# Altium schematic sheet LEDs.SchDoc: LEDs
size A4; Organization: Use Organization_Name in ProjParam; Address1: EFI & DBR; Address2: STI-IMT-LSRO1; Address3: EPFL; Address4: CH-1015 LAUSANNE; DocumentNumber: 10; Revision: A; SheetNumber: 10; SheetTotal: 2; ApprovedBy: Init ApprovedBy in DocParam; CheckedBy: Init CheckedBy in DocParam; Author: Init Author in DocParam; CompanyName: Init CompanyName in DocParam; DrawnBy: Init DrawBy in DocParam; Engineer: Init Engineer in DocParam; DocumentName: Init DocumentName in DocParam; ProjectName: Init ProjectName in DocParam
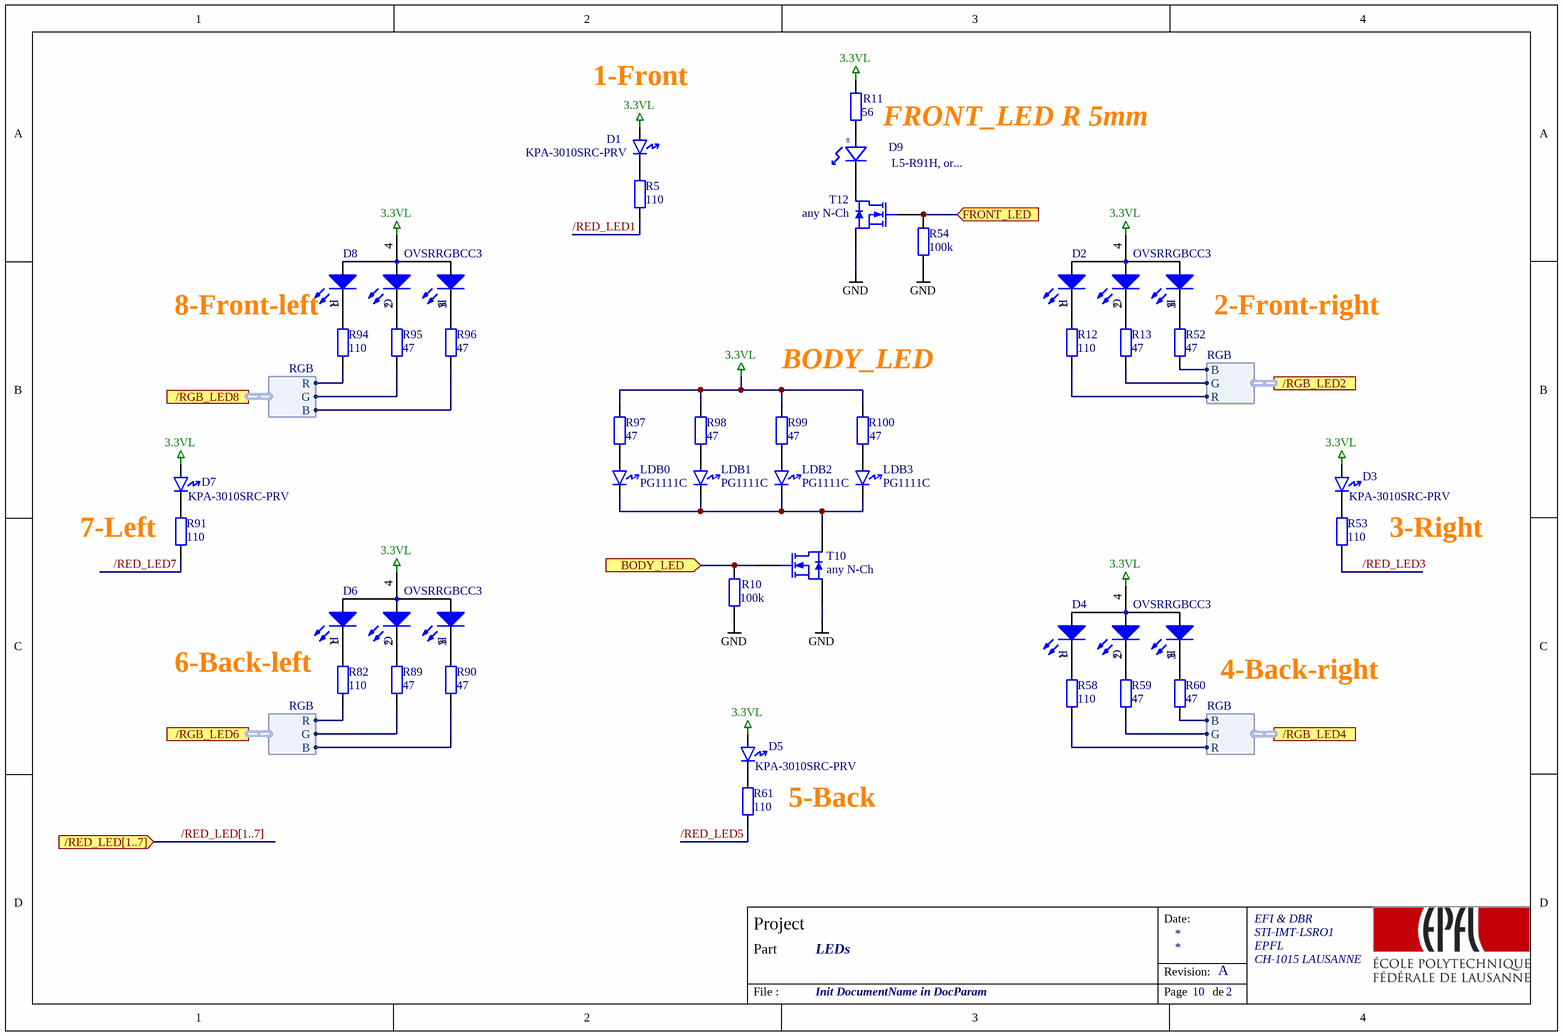
[diagram p0: LEDs.SchDoc]

## Parts
D1  value KPA-3010SRC-PRV  [KPA-3010SRC-PRV]  (hidden comment: side LED Red)
D2  OVSRRGBCC3  [OVSRRGBCC3-Edge]
D3  value KPA-3010SRC-PRV  [KPA-3010SRC-PRV]  (hidden comment: side LED Red)
D4  OVSRRGBCC3  [OVSRRGBCC3-Edge]
D5  value KPA-3010SRC-PRV  [KPA-3010SRC-PRV]  (hidden comment: side LED Red)
D6  OVSRRGBCC3  [OVSRRGBCC3-Edge]
D7  value KPA-3010SRC-PRV  [KPA-3010SRC-PRV]  (hidden comment: side LED Red)
D8  OVSRRGBCC3  [OVSRRGBCC3-Edge]
D9  value L5-R91H, or...  [LED5_90]  (hidden comment: Led R 5mm)
LDB0  value PG1111C  [ROB_LED_0603]  (hidden comment: led green)
LDB1  value PG1111C  [ROB_LED_0603]  (hidden comment: led green)
LDB2  value PG1111C  [ROB_LED_0603]  (hidden comment: led green)
LDB3  value PG1111C  [ROB_LED_0603]  (hidden comment: led green)
R5  110  [ROB_0603]
R10  100k  [ROB_0603]
R11  56  [ROB_0603]
R12  110  [ROB_0603]
R13  47  [ROB_0603]
R52  47  [ROB_0603]
R53  110  [ROB_0603]
R54  100k  [ROB_0603]
R58  110  [ROB_0603]
R59  47  [ROB_0603]
R60  47  [ROB_0603]
R61  110  [ROB_0603]
R82  110  [ROB_0603]
R89  47  [ROB_0603]
R90  47  [ROB_0603]
R91  110  [ROB_0603]
R94  110  [ROB_0603]
R95  47  [ROB_0603]
R96  47  [ROB_0603]
R97  47  [ROB_0603]
R98  47  [ROB_0603]
R99  47  [ROB_0603]
R100  47  [ROB_0603]
T10  any N-Ch  [SOT23-3 - NEW]
T12  any N-Ch  [SOT23-3 - NEW]

## Ports
/RED_LED[1..7] (in), /RGB_LED2 (harness RGB), /RGB_LED4 (harness RGB), /RGB_LED6 (harness RGB), /RGB_LED8 (harness RGB), BODY_LED (in), FRONT_LED (in)

## Harnesses
RGB: R, G, B

## Nets
3.3VL: D1.2(A) D2.4(A) D3.2(A) D4.4(A) D5.2(A) D6.4(A) D7.2(A) D8.4(A) R11.1 R97.1 R98.1 R99.1 R100.1
GND: R10.2 R54.2 T10.2(S) T12.2(S)
/RED_LED1: R5.1
/RED_LED3: R53.1
/RED_LED5: R61.1
/RED_LED7: R91.1
BODY_LED: R10.1 T10.1(G) ; port BODY_LED
FRONT_LED: R54.1 T12.1(G) ; port FRONT_LED
NetD1_1: D1.1(K) R5.2
NetD2_1: D2.1(K) R12.2
NetD2_2: D2.2(K) R13.2
NetD2_3: D2.3(K) R52.2
NetD3_1: D3.1(K) R53.2
NetD4_1: D4.1(K) R58.2
NetD4_2: D4.2(K) R59.2
NetD4_3: D4.3(K) R60.2
NetD5_1: D5.1(K) R61.2
NetD6_1: D6.1(K) R82.2
NetD6_2: D6.2(K) R89.2
NetD6_3: D6.3(K) R90.2
NetD7_1: D7.1(K) R91.2
NetD8_1: D8.1(K) R94.2
NetD8_2: D8.2(K) R95.2
NetD8_3: D8.3(K) R96.2
NetD9_1: D9.1(A) R11.2
NetD9_2: D9.2(K) T12.3(D)
NetLDB0_1: LDB0.1(K) LDB1.1(K) LDB2.1(K) LDB3.1(K) T10.3(D)
NetLDB0_2: LDB0.2(A) R97.2
NetLDB1_2: LDB1.2(A) R98.2
NetLDB2_2: LDB2.2(A) R99.2
NetLDB3_2: LDB3.2(A) R100.2
NetR12_1: R12.1 ; port /RGB_LED2.R
NetR13_1: R13.1 ; port /RGB_LED2.G
NetR52_1: R52.1 ; port /RGB_LED2.B
NetR58_1: R58.1 ; port /RGB_LED4.R
NetR59_1: R59.1 ; port /RGB_LED4.G
NetR60_1: R60.1 ; port /RGB_LED4.B
NetR82_1: R82.1 ; port /RGB_LED6.R
NetR89_1: R89.1 ; port /RGB_LED6.G
NetR90_1: R90.1 ; port /RGB_LED6.B
NetR94_1: R94.1 ; port /RGB_LED8.R
NetR95_1: R95.1 ; port /RGB_LED8.G
NetR96_1: R96.1 ; port /RGB_LED8.B

## Buses and harness runs
bus /RED_LED[1..7] = port /RED_LED[1..7]

## Notes on the sheet
- (near D1) 1-Front
- FRONT_LED R 5mm
- (near D8) 8-Front-left
- BODY_LED
- 2-Front-right
- (near R91) 7-Left
- 3-Right
- (near R82) 6-Back-left
- 4-Back-right
- 5-Back
- Date:
- Project
- Part
- Revision:
- File :
- Page
- de
- (in symbol LDIR_5MM) IR
- (in symbol OVSRRGBCC3) R; G; B

## Library data of the parts
D1 D3 D5 D7 = LED SMD: LED
D2 D4 D6 D8 = OVSRRGBCC3: side LED RGB SMD; Published: 8-Jun-2000; LatestRevisionDate: 08-Jul-2005; LatestRevisionNote: Mech Layer 1 removed.; PackageReference: OVSRRGBCC3; Publisher: Altium Limited; Value: OVSRRGBCC3
D9 = LDIR_5MM: strong red LED
LDB0-LDB3 = LED SMD: LED body
R5 R10-R13 R52-R54 R58-R61 R82 R89-R91 R94-R100 = Res2: Resistor; Published: 8-Jun-2000; LatestRevisionDate: 17-Jul-2002; LatestRevisionNote: Re-released for DXP Platform.; PackageReference: AXIAL-0.4; Publisher: Altium Limited
  R5 R12 R53 R58 R61 R82 R91 R94: Value: 110
  R10 R54: Value: 100k
  R11: Value: 56
  R13 R52 R59 R60 R89 R90 R95-R100: Value: 47
T10 T12 = IRLML6346TRPBF: N-Channel MOSFET Rds 0.063ohm@3.4A; PackageDocument: 1995/1996; Published: 8-Jun-2000; LatestRevisionDate: 17-Jul-2002; LatestRevisionNote: Re-released for DXP Platform.; PackageReference: E3; Publisher: Altium Limited; Value: any N-Ch